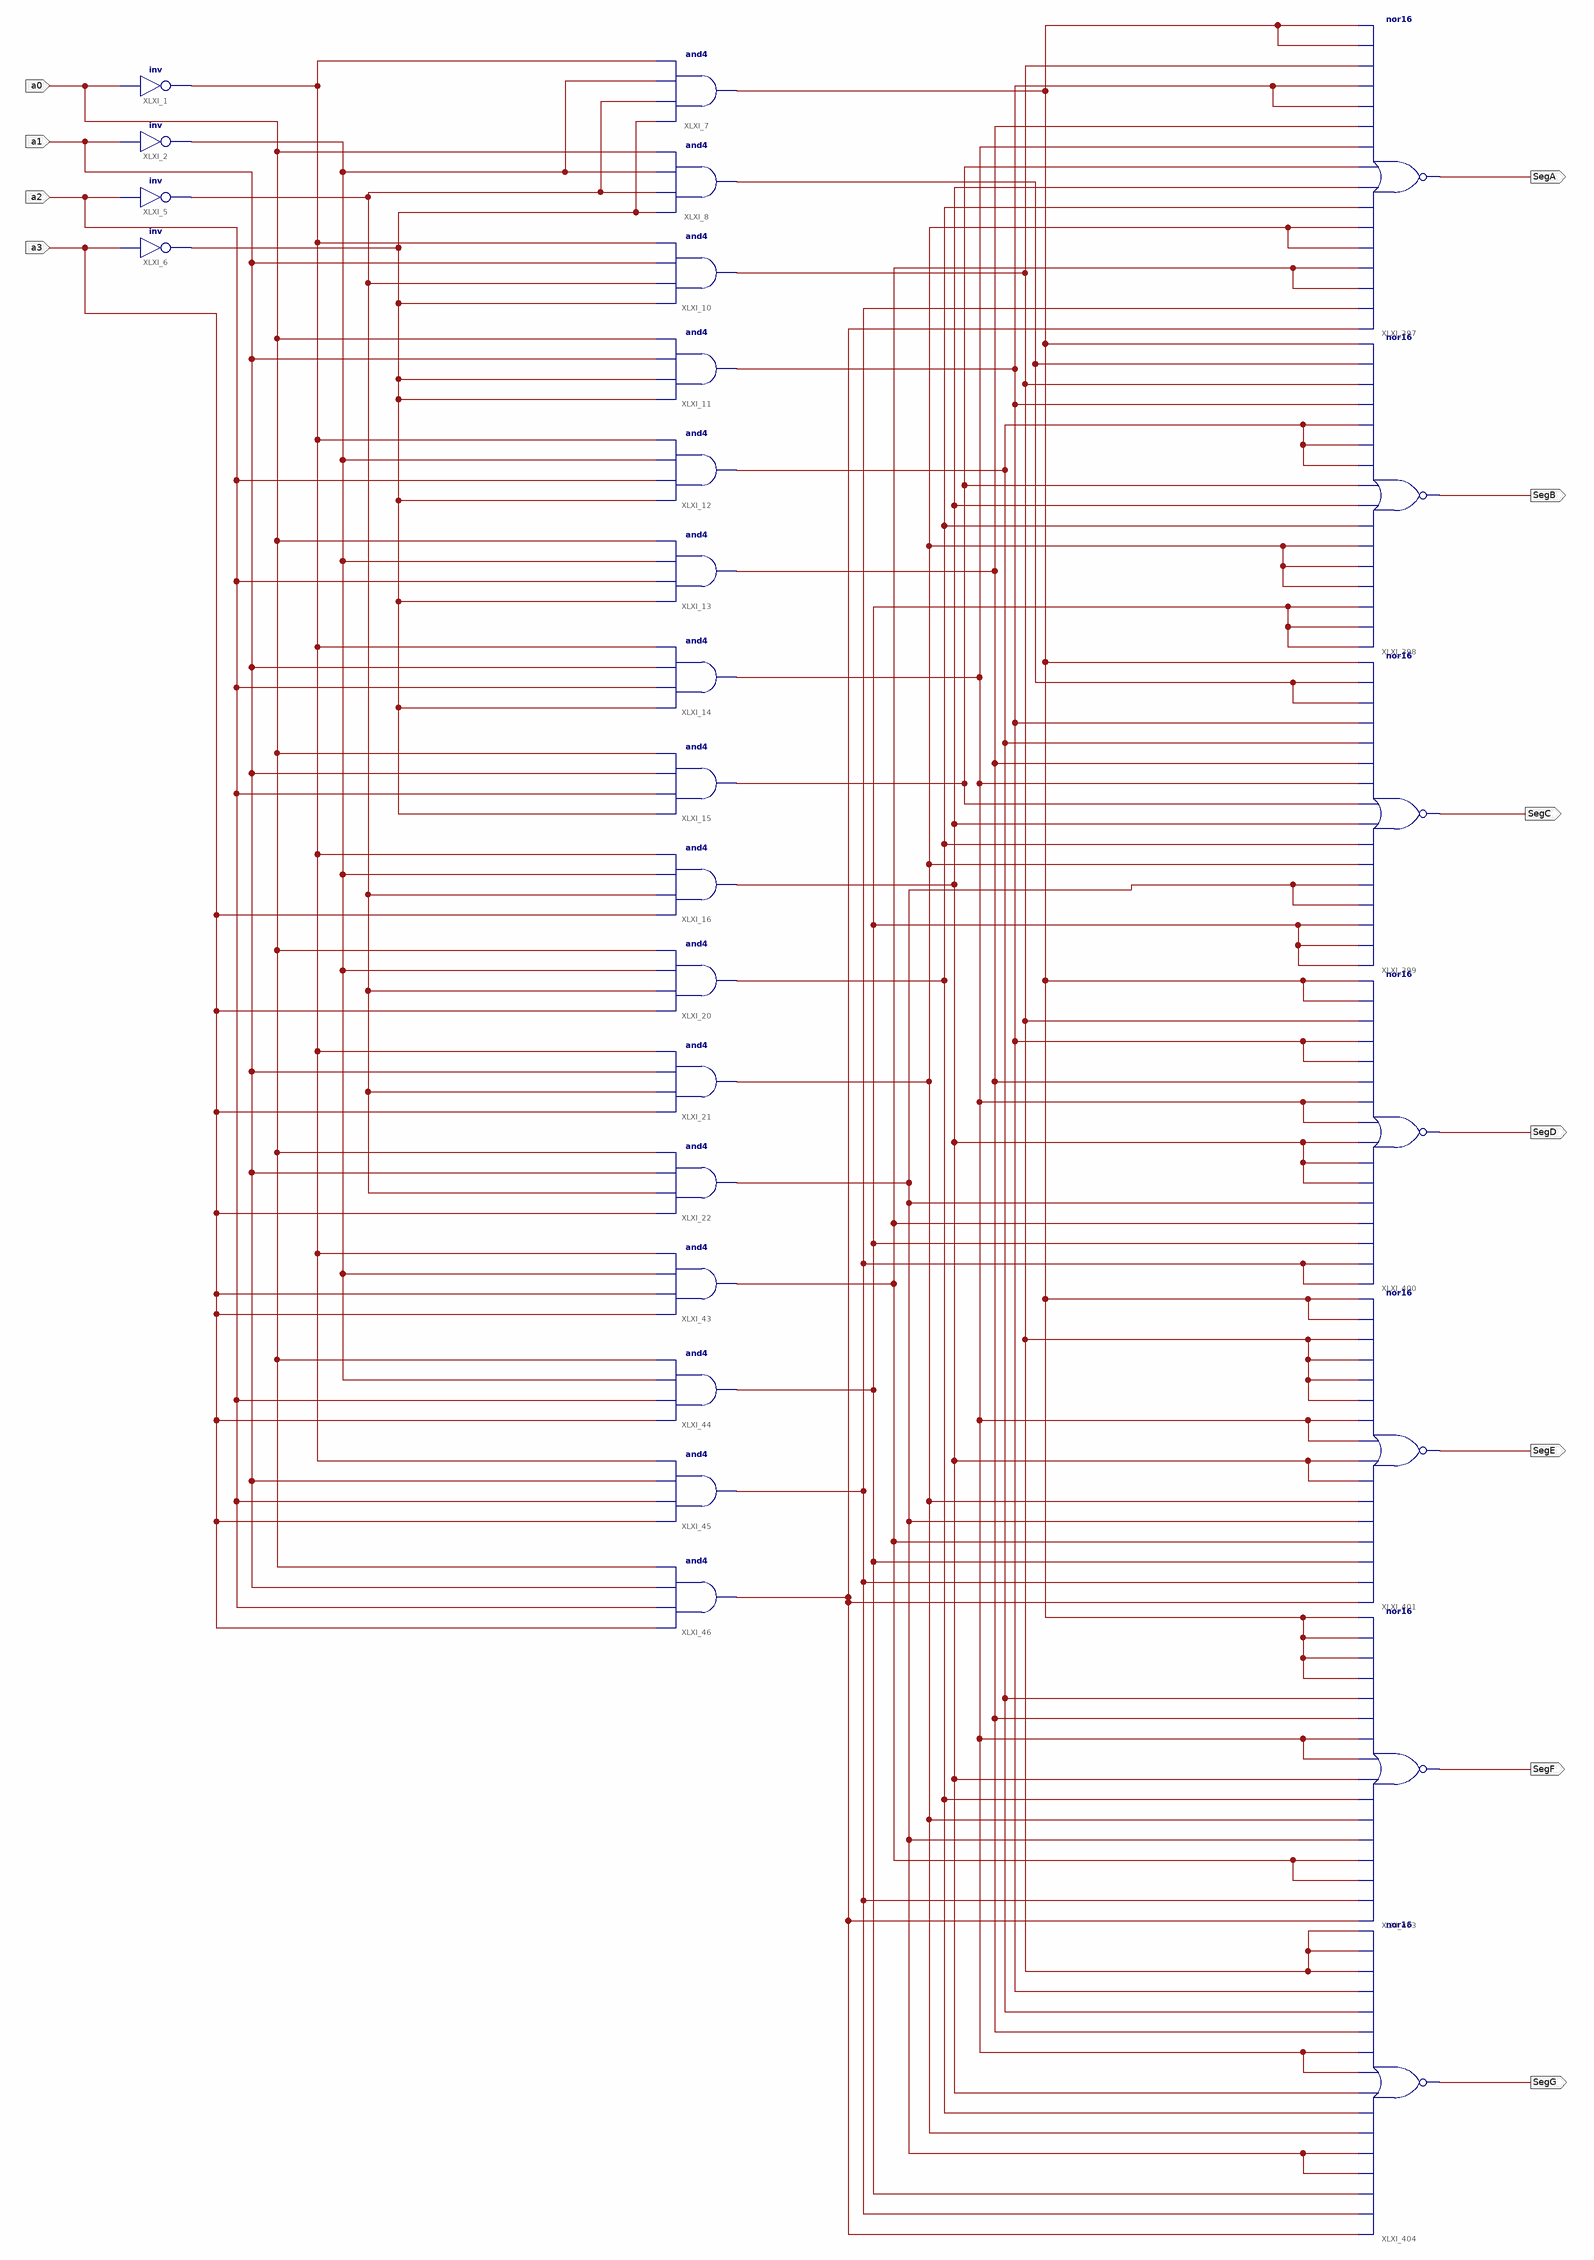
[diagram p0: schematic sheet 1]
// Xilinx ISE schematic bin_to_7seghex_sch.sch (spartan3e) as structural Verilog: 27 symbols, 11 ports
module bin_to_7seghex_sch (
  input  a1,
  input  a2,
  input  a3,
  input  a0,
  output SegA,
  output SegB,
  output SegC,
  output SegD,
  output SegE,
  output SegF,
  output SegG
);

  wire XLXN_24, XLXN_25, XLXN_27, XLXN_29, XLXN_31, XLXN_34, XLXN_74, XLXN_75, XLXN_76, XLXN_78, XLXN_80,
       XLXN_85, XLXN_163, XLXN_184, XLXN_197, XLXN_237, XLXN_289, XLXN_290, XLXN_291, XLXN_292;

  not XLXI_1 (XLXN_292, a0);
  not XLXI_2 (XLXN_291, a1);
  not XLXI_5 (XLXN_290, a2);
  not XLXI_6 (XLXN_289, a3);
  and XLXI_7 (XLXN_85, XLXN_289, XLXN_290, XLXN_291, XLXN_292);
  and XLXI_8 (XLXN_31, XLXN_289, XLXN_290, XLXN_291, a0);
  and XLXI_10 (XLXN_80, XLXN_289, XLXN_290, a1, XLXN_292);
  and XLXI_11 (XLXN_74, XLXN_289, XLXN_289, a1, a0);
  and XLXI_12 (XLXN_25, XLXN_289, a2, XLXN_291, XLXN_292);
  and XLXI_13 (XLXN_163, XLXN_289, a2, XLXN_291, a0);
  and XLXI_14 (XLXN_75, XLXN_289, a2, a1, XLXN_292);
  and XLXI_15 (XLXN_184, XLXN_289, a2, a1, a0);
  and XLXI_16 (XLXN_76, a3, XLXN_290, XLXN_291, XLXN_292);
  and XLXI_20 (XLXN_197, a3, XLXN_290, XLXN_291, a0);
  and XLXI_21 (XLXN_27, a3, XLXN_290, a1, XLXN_292);
  and XLXI_22 (XLXN_34, a3, XLXN_290, a1, a0);
  and XLXI_43 (XLXN_24, a3, a3, XLXN_291, XLXN_292);
  and XLXI_44 (XLXN_29, a3, a2, XLXN_291, a0);
  and XLXI_45 (XLXN_78, a3, a2, a1, XLXN_292);
  and XLXI_46 (XLXN_237, a3, a2, a1, a0);
  nor XLXI_404 (SegG, XLXN_237, XLXN_78, XLXN_29, XLXN_34, XLXN_34, XLXN_27, XLXN_197, XLXN_76, XLXN_75, XLXN_75, XLXN_163, XLXN_25, XLXN_74, XLXN_80, XLXN_80, XLXN_80);
  nor XLXI_403 (SegF, XLXN_237, XLXN_78, XLXN_24, XLXN_24, XLXN_34, XLXN_27, XLXN_197, XLXN_76, XLXN_75, XLXN_75, XLXN_163, XLXN_25, XLXN_85, XLXN_85, XLXN_85, XLXN_85);
  nor XLXI_401 (SegE, XLXN_237, XLXN_78, XLXN_29, XLXN_24, XLXN_34, XLXN_27, XLXN_76, XLXN_76, XLXN_75, XLXN_75, XLXN_80, XLXN_80, XLXN_80, XLXN_80, XLXN_85, XLXN_85);
  nor XLXI_400 (SegD, XLXN_78, XLXN_78, XLXN_29, XLXN_24, XLXN_34, XLXN_76, XLXN_76, XLXN_76, XLXN_75, XLXN_75, XLXN_163, XLXN_74, XLXN_74, XLXN_80, XLXN_85, XLXN_85);
  nor XLXI_399 (SegC, XLXN_29, XLXN_29, XLXN_29, XLXN_34, XLXN_34, XLXN_27, XLXN_197, XLXN_76, XLXN_184, XLXN_75, XLXN_163, XLXN_25, XLXN_74, XLXN_31, XLXN_31, XLXN_85);
  nor XLXI_398 (SegB, XLXN_29, XLXN_29, XLXN_29, XLXN_27, XLXN_27, XLXN_27, XLXN_197, XLXN_76, XLXN_184, XLXN_25, XLXN_25, XLXN_25, XLXN_74, XLXN_80, XLXN_31, XLXN_85);
  nor XLXI_397 (SegA, XLXN_237, XLXN_78, XLXN_24, XLXN_24, XLXN_27, XLXN_27, XLXN_197, XLXN_76, XLXN_184, XLXN_75, XLXN_163, XLXN_74, XLXN_74, XLXN_80, XLXN_85, XLXN_85);
endmodule
